# EAGLE schematic CapMeter-LCD-16F876A (EAGLE 7.7.0)
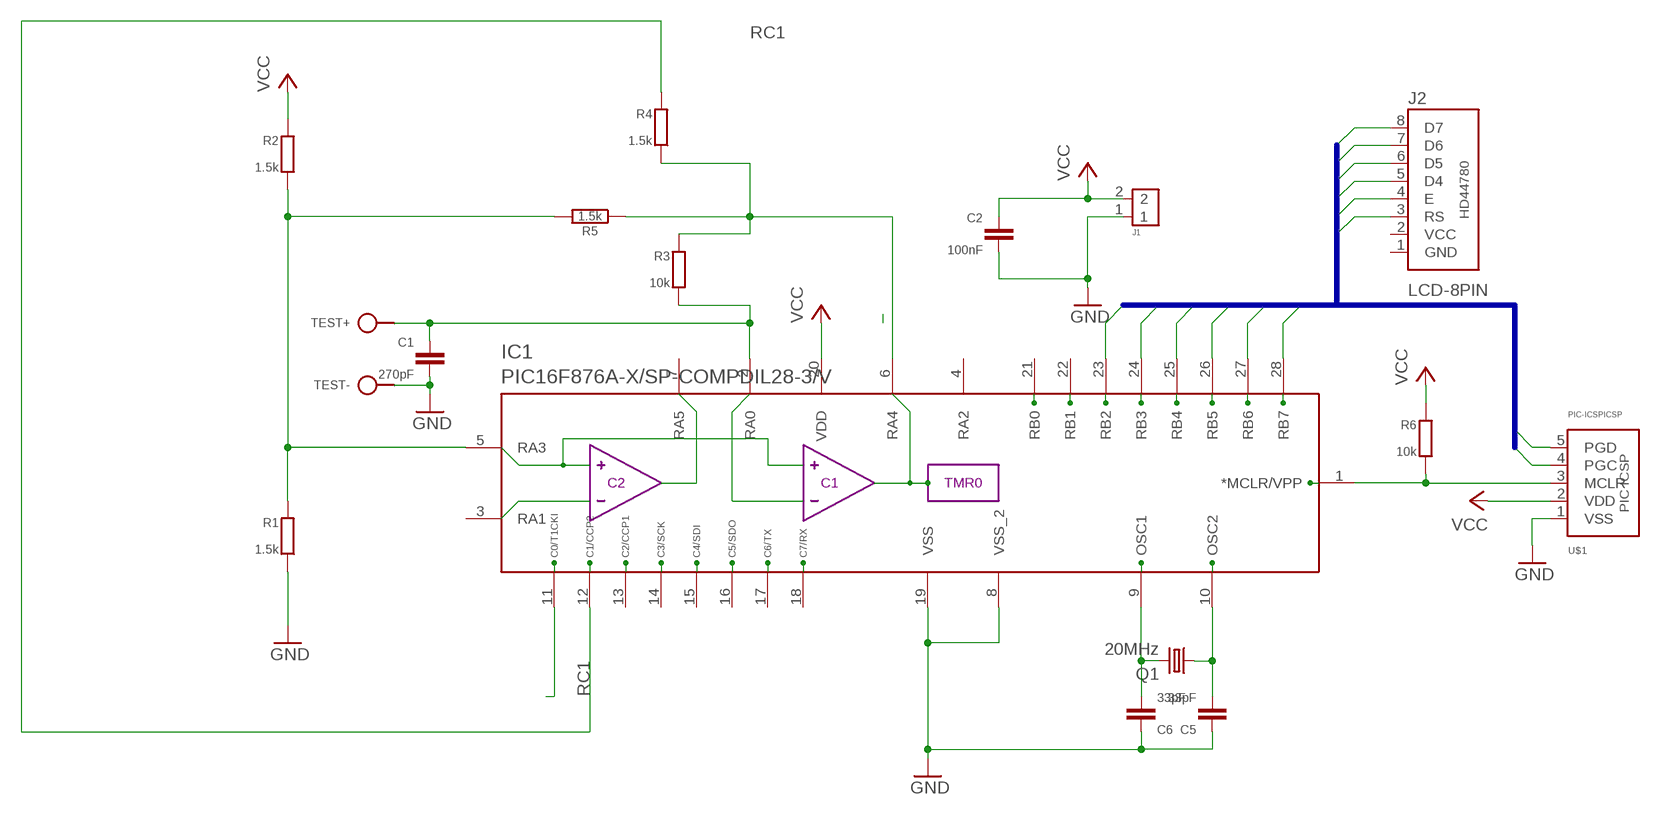
[diagram p0: schematic, sheet 1]

## Parts
C1  270pF  C050-020X036  [C050-020X036]
C2  100nF  C025-020X036  [C025-020X036]
C5  33pF  C025-020X036  [C025-020X036]
C6  33pF  C025-020X036  [C025-020X036]
IC1  PIC16F876A-X/SP-COMPDIL28-3/V  [DIL28-3/V]
J1  CONN-2P2P/H  [CONN-2P]
J2  LCD-8PIN  [1X8]
Q1  20MHz  CRYSTALHC49  [HC49]
R1  1.5k  R0204/10  [0204/10]
R2  1.5k  R0204/10  [0204/10]
R3  10k  R0204/10  [0204/10]
R4  1.5k  R0204/10  [0204/10]
R5  1.5k  R-H0202/10  [0202/10]
R6  10k  R0204/10-V  [0204/10-V]
TEST+  SPAD  [SPAD]
TEST-  SPAD  [SPAD]
U$1  PIC-ICSPICSP  [PIC-ICSP]

## Nets
D4: IC1.25(RB4) J2.5(D4)
D5: IC1.26(RB5) J2.6(D5)
D6: IC1.27(RB6) J2.7(D6) U$1.4(PGC)
D7: IC1.28(RB7) J2.8(D7) U$1.5(PGD)
E: IC1.24(RB3) J2.4(E)
GND: C1.2 C2.2 C5.1 C6.1 IC1.8(VSS_2) IC1.19(VSS) J1.1 R1.2 TEST-.1 U$1.1(VSS)
N$1: IC1.2(RA0) R3.2 TEST+.1
N$2: IC1.6(RA4) R3.1 R4.2 R5.1
N$3: IC1.5(RA3) R1.1 R2.2 R5.2
N$4: IC1.11(RC0)
N$6: IC1.1(*MCLR/VPP) R6.2 U$1.3(MCLR)
N$7: C1.1
OSC1: C6.2 IC1.9(OSC1) Q1.2
OSC2: C5.2 IC1.10(OSC2) Q1.1
RC1: IC1.12(RC1) R4.1
RS: IC1.23(RB2) J2.3(RS)
VCC: C2.1 IC1.20(VDD) J1.2 R2.1 R6.1 U$1.2(VDD)
Unconnected: IC1.3(RA1) IC1.4(RA2) IC1.7(RA5) IC1.13(RC2) IC1.14(RC3) IC1.15(RC4) IC1.16(RC5) IC1.17(RC6) IC1.18(RC7) IC1.21(RB0) IC1.22(RB1) J2.1(GND) J2.2(VCC)

## Buses
D[4..7],E,RS,VCC,GND

## Library data of the parts
C1 C2 C5 C6 = c:C: CAPACITOR, European symbol
IC1 = mcu:PIC16F876A-X/SP-COMP
J1 = pinconn:CONN-2P
J2 = lcd:LCD-8PIN
Q1 = q:CRYSTAL
R1-R4 R6 = r:R: RESISTOR, European symbol
R5 = r:R-H
TEST+ TEST- = pad:SPAD
U$1 = pinconn:PIC-ICSP

## Net classes
0 default: width 0.61 mm